# Altium schematic sheet MCU.SchDoc: MCU
size 292 x 193 mm; SheetNumber: 3; SheetTotal: 5
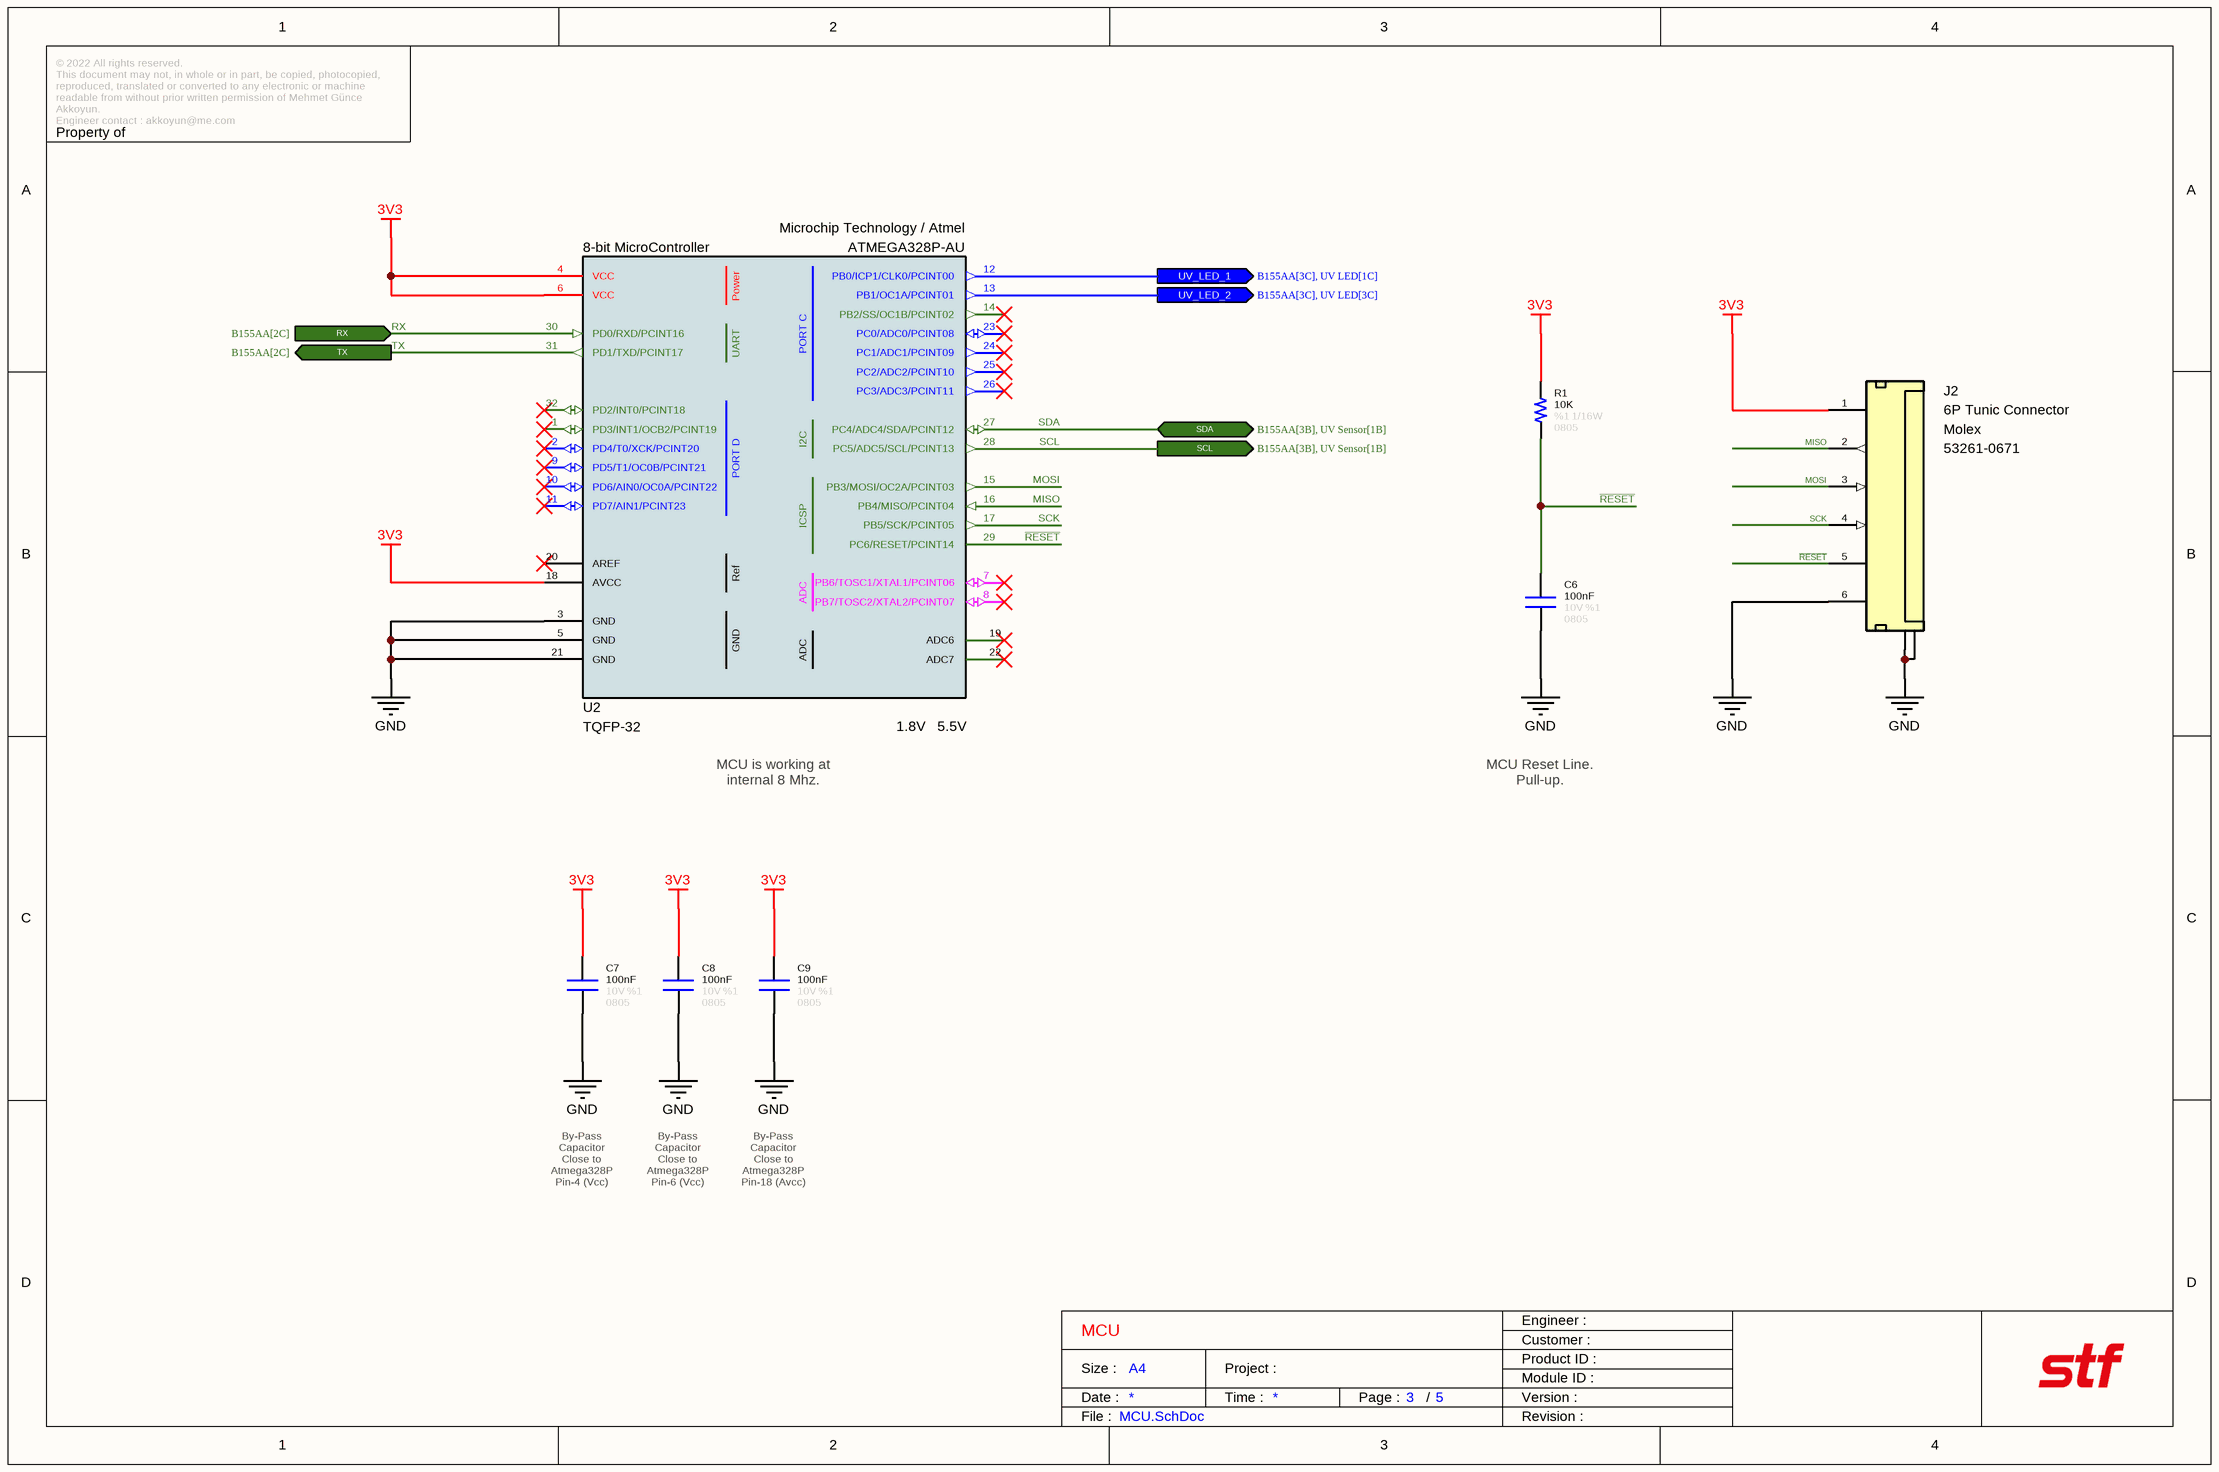
[diagram p0: MCU.SchDoc]

## Parts
C6  value 100nF  Tolerance: %1  Voltage: 10V  Case: 0805  [CAPACITOR_0805]  (hidden comment: Capacitor - 100nF [0805] (MLCC))
C7  value 100nF  Tolerance: %1  Voltage: 10V  Case: 0805  [CAPACITOR_0805]  (hidden comment: Capacitor - 100nF [0805] (MLCC))
C8  value 100nF  Tolerance: %1  Voltage: 10V  Case: 0805  [CAPACITOR_0805]  (hidden comment: Capacitor - 100nF [0805] (MLCC))
C9  value 100nF  Tolerance: %1  Voltage: 10V  Case: 0805  [CAPACITOR_0805]  (hidden comment: Capacitor - 100nF [0805] (MLCC))
J2  6P Tunic Connector  Manufacturer Part Number: 53261-0671  Manufacturer Name: Molex  [Connector_Tunic 6P]
R1  value 10K  Tolerance: %1  Case: 0805  Power: 1/16W  [RESISTOR_0805]  (hidden comment: 10K - 0805 - %1 - 1/16W)
U2  8-bit MicroController  Supply Voltage - Max: 5.5V  Supply Voltage - Min: 1.8V  Manufacturer Name: Microchip Technology / Atmel  Manufacturer Part Number: ATMEGA328P-AU  Case: TQFP-32  [TQFN-32]

## Ports
RX (in, see B155AA[2C]), SCL (out, see B155AA[3B], UV Sensor[1B]), SDA (bidir, see B155AA[3B], UV Sensor[1B]), TX (out, see B155AA[2C]), UV_LED_1 (out, see B155AA[3C], UV LED[1C]), UV_LED_2 (out, see B155AA[3C], UV LED[3C])

## Nets
3V3: C7.2 C8.2 C9.2 J2.1(VBAT) R1.2 U2.4(VCC) U2.6(VCC) U2.18(AVCC)
GND: C6.1 C7.1 C8.1 C9.1 J2.6(M_DRV) J2.7(GND) J2.8(GND) U2.3(GND) U2.5(GND) U2.21(GND)
MISO: J2.2(M_DRV) U2.16(PB4/MISO/PCINT04)
MOSI: J2.3(M_DRV) U2.15(PB3/MOSI/OC2A/PCINT03)
~{RESET}: C6.2 J2.5(M_DRV) R1.1 U2.29(PC6/RESET/PCINT14)
RX: U2.30(PD0/RXD/PCINT16) ; port RX
SCK: J2.4(M_DRV) U2.17(PB5/SCK/PCINT05)
SCL: U2.28(PC5/ADC5/SCL/PCINT13) ; port SCL
SDA: U2.27(PC4/ADC4/SDA/PCINT12) ; port SDA
TX: U2.31(PD1/TXD/PCINT17) ; port TX
UV_LED_1: U2.12(PB0/ICP1/CLK0/PCINT00) ; port UV_LED_1
UV_LED_2: U2.13(PB1/OC1A/PCINT01) ; port UV_LED_2

Not connected (* = marked no-connect by the designer): U2 1(PD3/INT1/OCB2/PCINT19)* 2(PD4/T0/XCK/PCINT20)* 7(PB6/TOSC1/XTAL1/PCINT06)* 8(PB7/TOSC2/XTAL2/PCINT07)* 9(PD5/T1/OC0B/PCINT21)* 10(PD6/AIN0/OC0A/PCINT22)* 11(PD7/AIN1/PCINT23)* 14(PB2/SS/OC1B/PCINT02)* 19(ADC6)* 20(AREF)* 22(ADC7)* 23(PC0/ADC0/PCINT08)* 24(PC1/ADC1/PCINT09)* 25(PC2/ADC2/PCINT10)* 26(PC3/ADC3/PCINT11)* 32(PD2/INT0/PCINT18)*

## Notes on the sheet
- MCU is working at internal 8 Mhz.
- MCU Reset Line. Pull-up.
- By-Pass Capacitor
  Close to Atmega328P
  Pin-4 (Vcc)
- By-Pass Capacitor
  Close to Atmega328P
  Pin-6 (Vcc)
- By-Pass Capacitor
  Close to Atmega328P
  Pin-18 (Avcc)
- © 2022 All rights reserved.
  This document may not, in whole or in part, be copied, photocopied, reproduced, translated or converted to any electronic or machine readable from without prior written permission of Mehmet Günce Akkoyun.
  Engineer contact : akkoyun@me.com
- Property of
- Engineer :
- Date :
- Size :
- A4
- Time :
- Project :
- Page :
- /
- Customer :
- Product ID :
- Module ID :
- Version :
- File :
- Revision :
- (in symbol IC - ATMEGA328P-AU) Power; PORT C; UART; I2C; PORT D; ICSP; Ref; ADC

## Library data of the parts
C6-C9 = Capacitor - 100nF [0805-10V]: Capacitor (MLCC) - 100nF / 10V / 0805; Manufacturer Name: KEMET; Manufacturer Part Number: C0805C104K8JACAUTO; Subcategory: Capacitors
J2 = Connector - Mini Tunic 6P (1.25): Mini Tunic Connector with 6P; ROHS: Yes
R1 = Resistor - 10K [0805]: Thick Film Resistors - SMD 1/16 W 10 KOhm 1%; Manufacturer Name: Vishay; Manufacturer Part Number: CRCW040210K0FKED; ComponentLink1Description: DataSheet; ComponentLink1URL: https://www.mouser.com.tr/datasheet/2/427/dcrcwe3-1762152.pdf; ComponentLink2Description: Mouser; ComponentLink2URL: https://www.mouser.com.tr/ProductDetail/Vishay-Dale/CRCW040210K0FKED?qs=sGAEpiMZZMu61qfTUdNhG2DpbjADlD3GcalbOv9utCY%3D
U2 = IC - ATMEGA328P-AU: 8-bit Microcontrollers - MCU 32KB In-system Flash 20MHz 1.8V-5.5V; Height: 1mm; ComponentLink1Description: DataSheet; ComponentLink1URL: http://ww1.microchip.com/downloads/en/DeviceDoc/ATmega48A-PA-88A-PA-168A-PA-328-P-DS-DS40002061A.pdf; ROHS: Yes; Minimum Operating Temperature: -40; Maximum Operating Temperature: +85; ComponentLink2Description: Mouser; ComponentLink2URL: https://www.mouser.com.tr/ProductDetail/Microchip-Technology-Atmel/ATMEGA328P-AU?qs=sGAEpiMZZMtVoztFdqDXO3RbBx7FKCmV; ComponentLink3Description: ProductPage; ComponentLink3URL: https://www.microchip.com/wwwproducts/en/ATmega328p